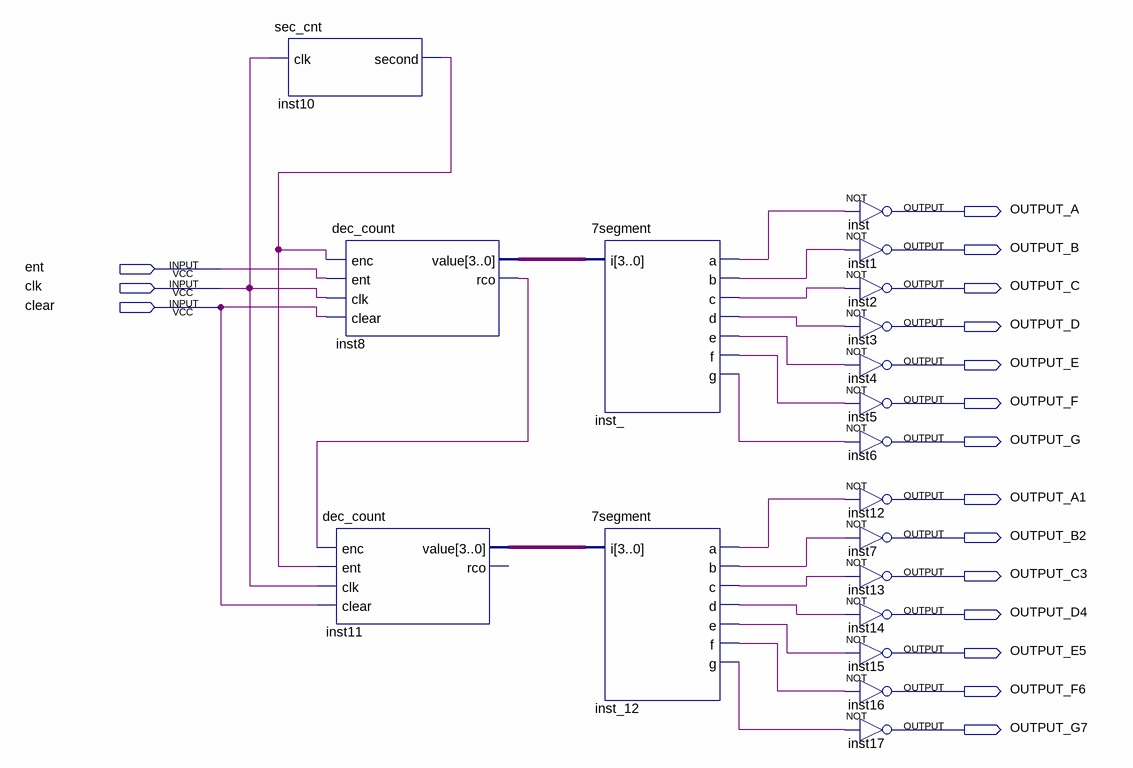
[diagram p0: schematic sheet]
// Quartus schematic YL_7SegmentDecoder.bdf as structural Verilog: 19 symbols, 17 pins
module YL_7SegmentDecoder (
  input  ent,
  input  clk,
  input  clear,
  output OUTPUT_A,
  output OUTPUT_B,
  output OUTPUT_C,
  output OUTPUT_D,
  output OUTPUT_E,
  output OUTPUT_F,
  output OUTPUT_G,
  output OUTPUT_A1,
  output OUTPUT_B2,
  output OUTPUT_C3,
  output OUTPUT_D4,
  output OUTPUT_E5,
  output OUTPUT_F6,
  output OUTPUT_G7
);

  wire inst8_rco, inst10_second, inst_12_a, inst_12_b, inst_12_c, inst_12_d, inst_12_e, inst_12_f, inst_12_g,
       inst__a, inst__b, inst__c, inst__d, inst__e, inst__f, inst__g;
  wire [3:0] inst8_value, inst11_value;

  sec_cnt inst10 (.clk(clk), .second(inst10_second));
  dec_count inst8 (.enc(inst10_second), .ent(ent), .clk(clk), .clear(clear), .value(inst8_value), .rco(inst8_rco));
  dec_count inst11 (.enc(inst8_rco), .ent(inst10_second), .clk(clk), .clear(clear), .value(inst11_value));  // open: rco
  \7segment  inst_ (
    .i(inst8_value), .a(inst__a), .b(inst__b), .c(inst__c), .d(inst__d), .e(inst__e), .f(inst__f), .g(inst__g));
  \7segment  inst_12 (
    .i(inst11_value), .a(inst_12_a), .b(inst_12_b), .c(inst_12_c), .d(inst_12_d), .e(inst_12_e),
    .f(inst_12_f), .g(inst_12_g));
  not inst (OUTPUT_A, inst__a);
  not inst1 (OUTPUT_B, inst__b);
  not inst2 (OUTPUT_C, inst__c);
  not inst3 (OUTPUT_D, inst__d);
  not inst4 (OUTPUT_E, inst__e);
  not inst5 (OUTPUT_F, inst__f);
  not inst6 (OUTPUT_G, inst__g);
  not inst12 (OUTPUT_A1, inst_12_a);
  not inst7 (OUTPUT_B2, inst_12_b);
  not inst13 (OUTPUT_C3, inst_12_c);
  not inst14 (OUTPUT_D4, inst_12_d);
  not inst15 (OUTPUT_E5, inst_12_e);
  not inst16 (OUTPUT_F6, inst_12_f);
  not inst17 (OUTPUT_G7, inst_12_g);
endmodule
